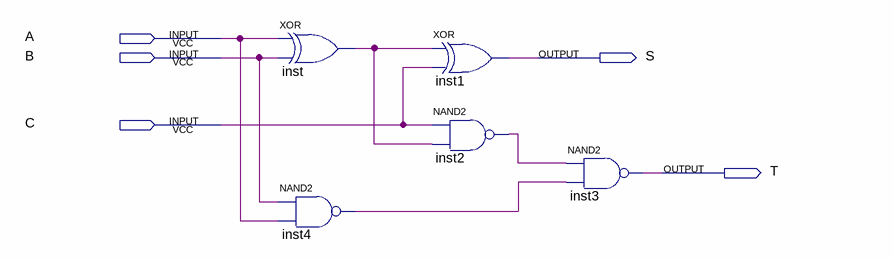
[diagram p0: schematic sheet]
// Quartus schematic Multiple_Output_Circuit.bdf as structural Verilog: 5 symbols, 5 pins
module Multiple_Output_Circuit (
  input  A,
  input  B,
  input  C,
  output S,
  output T
);

  wire inst2_out, inst4_out, inst_out;

  xor inst (inst_out, A, B);
  nand inst4 (inst4_out, B, A);
  xor inst1 (S, inst_out, C);
  nand inst2 (inst2_out, C, inst_out);
  nand inst3 (T, inst2_out, inst4_out);
endmodule
